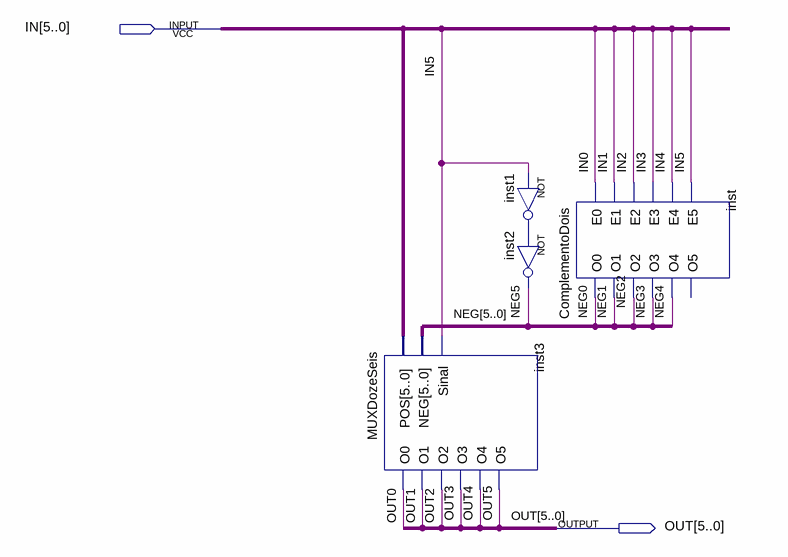
[diagram p0: schematic sheet]
// Quartus schematic Descomplementador.bdf as structural Verilog: 4 symbols, 2 pins
module Descomplementador (
  input  [5:0] IN,
  output [5:0] OUT
);

  wire inst1_out;
  wire [5:0] NEG;

  MUXDozeSeis inst3 (
    .POS(IN), .NEG(NEG), .Sinal(IN[5]), .O0(OUT[0]), .O1(OUT[1]), .O2(OUT[2]), .O3(OUT[3]), .O4(OUT[4]),
    .O5(OUT[5]));
  not inst1 (inst1_out, IN[5]);
  not inst2 (NEG[5], inst1_out);
  ComplementoDois inst (
    .E0(IN[0]), .E1(IN[1]), .E2(IN[2]), .E3(IN[3]), .E4(IN[4]), .E5(IN[5]), .O0(NEG[0]), .O1(NEG[1]),
    .O2(NEG[2]), .O3(NEG[3]), .O4(NEG[4]));  // open: O5
endmodule
